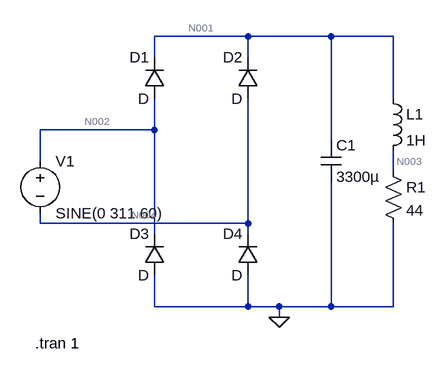
[diagram p0: schematic Retificador Monofásico.asc]
Retificador Monofásico.asc, the LTspice schematic file:
Version 4.1
SHEET 1 880 680
WIRE 336 -80 192 -80
WIRE 464 -80 336 -80
WIRE 560 -80 464 -80
WIRE 192 -48 192 -80
WIRE 336 -48 336 -80
WIRE 560 16 560 -80
WIRE 192 64 192 16
WIRE 192 64 16 64
WIRE 464 80 464 -80
WIRE 16 112 16 64
WIRE 560 128 560 96
WIRE 16 208 16 192
WIRE 336 208 336 16
WIRE 336 208 16 208
WIRE 192 224 192 64
WIRE 336 224 336 208
WIRE 192 336 192 288
WIRE 336 336 336 288
WIRE 336 336 192 336
WIRE 384 336 336 336
WIRE 464 336 464 144
WIRE 464 336 384 336
WIRE 560 336 560 208
WIRE 560 336 464 336
WIRE 384 352 384 336
FLAG 384 352 0
SYMBOL res 544 112 R0
SYMATTR InstName R1
SYMATTR Value 44
SYMBOL ind 544 0 R0
SYMATTR InstName L1
SYMATTR Value 1H
SYMBOL voltage 16 96 R0
WINDOW 123 0 0 Left 0
WINDOW 39 0 0 Left 0
SYMATTR InstName V1
SYMATTR Value SINE(0 311 60)
SYMBOL diode 208 16 R180
WINDOW 0 24 64 Left 2
WINDOW 3 24 0 Left 2
SYMATTR InstName D1
SYMBOL diode 352 16 R180
WINDOW 0 24 64 Left 2
WINDOW 3 24 0 Left 2
SYMATTR InstName D2
SYMBOL diode 208 288 R180
WINDOW 0 24 64 Left 2
WINDOW 3 24 0 Left 2
SYMATTR InstName D3
SYMBOL diode 352 288 R180
WINDOW 0 24 64 Left 2
WINDOW 3 24 0 Left 2
SYMATTR InstName D4
SYMBOL cap 448 80 R0
SYMATTR InstName C1
SYMATTR Value 3300µ
TEXT 8 392 Left 2 !.tran 1

The netlist it stands for:
* Retificador Monofásico.asc
R1 N003 0 44
L1 N001 N003 1H
V1 N002 N004 SINE(0 311 60)
D1 N002 N001 D
D2 N004 N001 D
D3 0 N002 D
D4 0 N004 D
C1 N001 0 3300µ
.model D D
.lib standard.dio
.tran 1
.backanno
.end

* Results of the author's LTspice run, read from the files saved beside the schematic
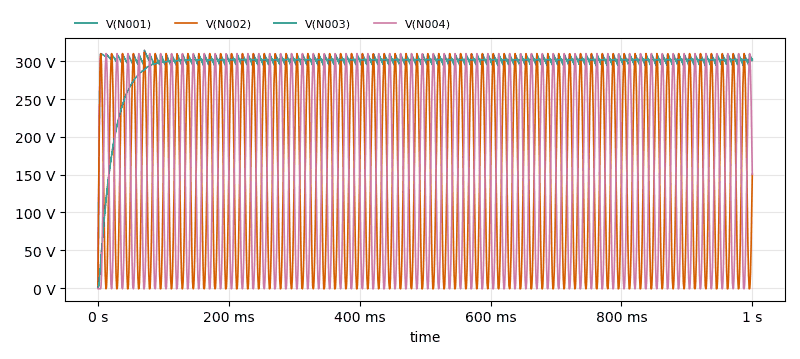
[diagram p1: Transient Analysis of Retificador Monofásico.asc, plotted from the saved traces]
* Transient Analysis, 1 run:
*   V(N001): min 0 V, max 314.4 V, average 301.9 V, rms 302.1 V, last 300.8 V
*   V(N002): min -961.5 mV, max 312.1 V, average 151 V, rms 187.1 V, last 150.4 V
*   V(N003): min 0 V, max 302.5 V, average 295 V, rms 296.9 V, last 302.4 V
*   V(N004): min -987.9 mV, max 310.2 V, average 151 V, rms 187.2 V, last 150.4 V